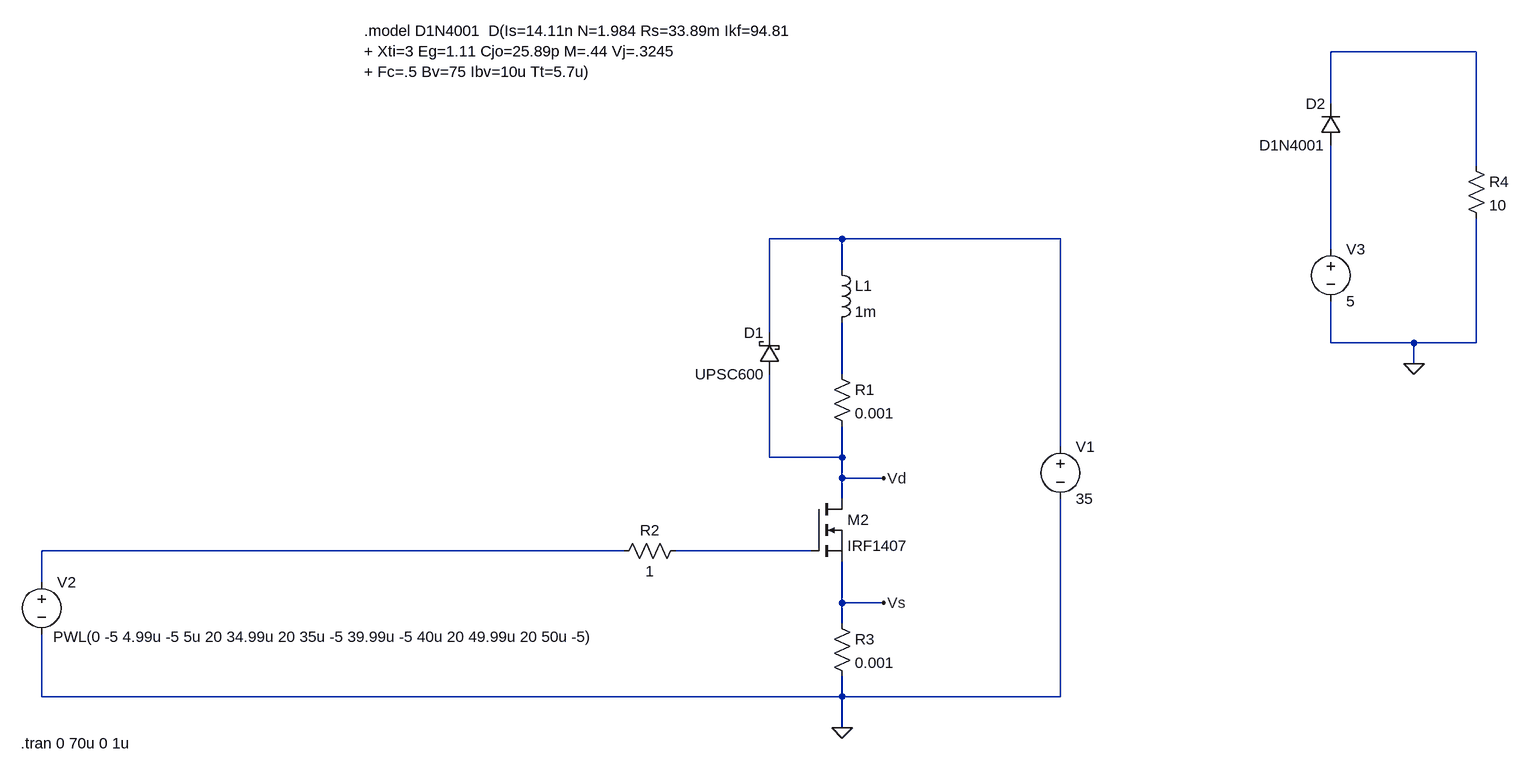
[diagram p0: schematic Draft1.asc]
Draft1.asc, the LTspice schematic file:
Version 4
SHEET 1 2184 1140
WIRE 2096 32 1872 32
WIRE 1872 112 1872 32
WIRE 2096 208 2096 32
WIRE 1120 320 1008 320
WIRE 1456 320 1120 320
WIRE 1872 336 1872 176
WIRE 1120 368 1120 320
WIRE 1008 464 1008 320
WIRE 1872 480 1872 416
WIRE 2000 480 1872 480
WIRE 2096 480 2096 288
WIRE 2096 480 2000 480
WIRE 2000 512 2000 480
WIRE 1120 528 1120 448
WIRE 1456 640 1456 320
WIRE 1008 656 1008 528
WIRE 1120 656 1120 608
WIRE 1120 656 1008 656
WIRE 1120 688 1120 656
WIRE 1184 688 1120 688
WIRE 1120 720 1120 688
WIRE 784 800 -112 800
WIRE 1072 800 864 800
WIRE -112 848 -112 800
WIRE 1120 880 1120 816
WIRE 1184 880 1120 880
WIRE 1120 912 1120 880
WIRE -112 1024 -112 928
WIRE 1120 1024 1120 992
WIRE 1120 1024 -112 1024
WIRE 1456 1024 1456 720
WIRE 1456 1024 1120 1024
WIRE 1120 1072 1120 1024
FLAG 1120 1072 0
FLAG 1184 688 Vd
FLAG 1184 880 Vs
FLAG 2000 512 0
SYMBOL voltage 1456 624 R0
WINDOW 123 0 0 Left 0
WINDOW 39 0 0 Left 0
SYMATTR InstName V1
SYMATTR Value 35
SYMBOL ind 1104 352 R0
SYMATTR InstName L1
SYMATTR Value 1m
SYMBOL res 1104 512 R0
SYMATTR InstName R1
SYMATTR Value 0.001
SYMBOL nmos 1072 720 R0
SYMATTR InstName M2
SYMATTR Value IRF1407
SYMBOL schottky 1024 528 R180
WINDOW 0 24 64 Left 2
WINDOW 3 24 0 Left 2
SYMATTR InstName D1
SYMATTR Value UPSC600
SYMATTR Description Diode
SYMATTR Type diode
SYMBOL res 880 784 R90
WINDOW 0 0 56 VBottom 2
WINDOW 3 32 56 VTop 2
SYMATTR InstName R2
SYMATTR Value 1
SYMBOL voltage -112 832 R0
WINDOW 3 18 100 Left 2
WINDOW 123 0 0 Left 0
WINDOW 39 0 0 Left 0
SYMATTR Value PWL(0 -5 4.99u -5 5u 20 34.99u 20 35u -5 39.99u -5 40u 20 49.99u 20 50u -5)
SYMATTR InstName V2
SYMBOL res 1104 896 R0
SYMATTR InstName R3
SYMATTR Value 0.001
SYMBOL diode 1888 176 R180
WINDOW 0 24 64 Left 2
WINDOW 3 24 0 Left 2
SYMATTR InstName D2
SYMATTR Value D1N4001
SYMBOL voltage 1872 320 R0
WINDOW 123 0 0 Left 0
WINDOW 39 0 0 Left 0
SYMATTR InstName V3
SYMATTR Value 5
SYMBOL res 2080 192 R0
SYMATTR InstName R4
SYMATTR Value 10
TEXT -144 1096 Left 2 !.tran 0 70u 0 1u
TEXT 384 0 Left 2 !.model D1N4001  D(Is=14.11n N=1.984 Rs=33.89m Ikf=94.81\n+ Xti=3 Eg=1.11 Cjo=25.89p M=.44 Vj=.3245\n+ Fc=.5 Bv=75 Ibv=10u Tt=5.7u)

The netlist it stands for:
* Draft1.asc
V1 N002 0 35
L1 N002 N004 1m
R1 N004 Vd 0.001
M2 Vd N006 Vs Vs IRF1407
D1 Vd N002 UPSC600
R2 N006 N005 1
V2 N005 0 PWL(0 -5 4.99u -5 5u 20 34.99u 20 35u -5 39.99u -5 40u 20 49.99u 20 50u -5)
R3 Vs 0 0.001
D2 N003 N001 D1N4001
V3 N003 0 5
R4 N001 0 10
.model D D
.lib standard.dio
.model NMOS NMOS
.model PMOS PMOS
.lib standard.mos
.tran 0 70u 0 1u
.model D1N4001  D(Is=14.11n N=1.984 Rs=33.89m Ikf=94.81
+ Xti=3 Eg=1.11 Cjo=25.89p M=.44 Vj=.3245
+ Fc=.5 Bv=75 Ibv=10u Tt=5.7u)
.backanno
.end